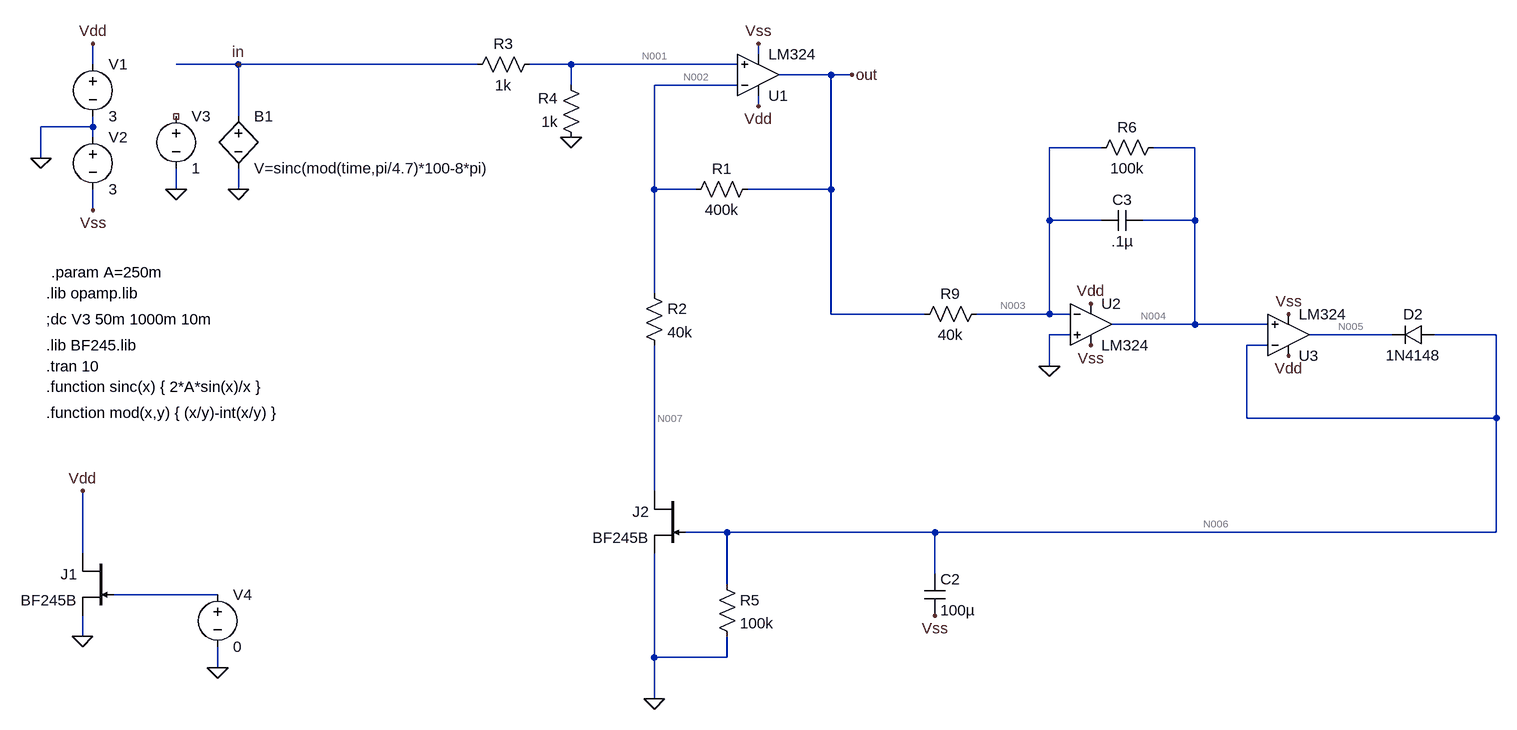
[diagram p0: schematic agc_8.asc]
agc_8.asc, the LTspice schematic file:
Version 4
SHEET 1 2280 940
WIRE 224 -176 224 -192
WIRE -800 -160 -800 -192
WIRE -576 -160 -672 -160
WIRE -208 -160 -576 -160
WIRE -64 -160 -128 -160
WIRE 192 -160 -64 -160
WIRE 336 -144 256 -144
WIRE 368 -144 336 -144
WIRE -64 -128 -64 -160
WIRE 192 -128 64 -128
WIRE 224 -96 224 -112
WIRE -576 -80 -576 -160
WIRE -800 -64 -800 -80
WIRE -800 -64 -880 -64
WIRE -800 -48 -800 -64
WIRE 752 -32 672 -32
WIRE 896 -32 832 -32
WIRE -880 -16 -880 -64
WIRE -672 32 -672 0
WIRE -576 32 -576 0
WIRE 64 32 64 -128
WIRE 128 32 64 32
WIRE 336 32 336 -144
WIRE 336 32 208 32
WIRE -800 64 -800 32
WIRE 672 80 672 -32
WIRE 752 80 672 80
WIRE 896 80 896 -32
WIRE 896 80 816 80
WIRE 64 192 64 32
WIRE 336 224 336 32
WIRE 480 224 336 224
WIRE 672 224 672 80
WIRE 672 224 560 224
WIRE 704 224 672 224
WIRE 896 240 896 80
WIRE 896 240 768 240
WIRE 1008 240 896 240
WIRE 704 256 672 256
WIRE 1200 256 1072 256
WIRE 1360 256 1264 256
WIRE 1008 272 976 272
WIRE 672 304 672 256
WIRE 976 384 976 272
WIRE 1360 384 1360 256
WIRE 1360 384 976 384
WIRE 64 496 64 272
WIRE 176 560 112 560
WIRE 496 560 176 560
WIRE 1360 560 1360 384
WIRE 1360 560 496 560
WIRE -816 592 -816 496
WIRE 496 624 496 560
WIRE 176 640 176 560
WIRE -608 656 -768 656
WIRE -816 720 -816 688
WIRE 64 752 64 592
WIRE 176 752 176 720
WIRE 176 752 64 752
WIRE -608 768 -608 736
WIRE 64 816 64 752
FLAG -880 -16 0
FLAG -800 -192 Vdd
FLAG 224 -96 Vdd
FLAG 224 -192 Vss
FLAG -800 64 Vss
FLAG -576 32 0
FLAG 368 -144 out
FLAG -576 -160 in
FLAG -816 720 0
FLAG -816 496 Vdd
FLAG -608 768 0
FLAG 1040 224 Vss
FLAG 1040 288 Vdd
FLAG 64 816 0
FLAG -64 -48 0
FLAG -672 32 0
FLAG 736 272 Vss
FLAG 736 208 Vdd
FLAG 672 304 0
FLAG 496 688 Vss
SYMBOL voltage -800 -176 R0
SYMATTR InstName V1
SYMATTR Value 3
SYMBOL voltage -800 -64 R0
SYMATTR InstName V2
SYMATTR Value 3
SYMBOL res 224 16 R90
WINDOW 0 0 56 VBottom 2
WINDOW 3 32 56 VTop 2
SYMATTR InstName R1
SYMATTR Value 400k
SYMBOL njf -768 592 M0
SYMATTR InstName J1
SYMATTR Value BF245B
SYMBOL voltage -608 640 R0
SYMATTR InstName V4
SYMATTR Value 0
SYMBOL Opamps\\opamp2 224 -80 M180
SYMATTR InstName U1
SYMATTR Value LM324
SYMBOL Opamps\\opamp2 1040 320 M180
SYMATTR InstName U3
SYMATTR Value LM324
SYMBOL diode 1264 240 R90
WINDOW 0 0 32 VBottom 2
WINDOW 3 32 32 VTop 2
SYMATTR InstName D2
SYMATTR Value 1N4148
SYMBOL njf 112 496 M0
SYMATTR InstName J2
SYMATTR Value BF245B
SYMBOL res 48 176 R0
SYMATTR InstName R2
SYMATTR Value 40k
SYMBOL res 160 624 R0
SYMATTR InstName R5
SYMATTR Value 100k
SYMBOL res -112 -176 R90
WINDOW 0 0 56 VBottom 2
WINDOW 3 32 56 VTop 2
SYMATTR InstName R3
SYMATTR Value 1k
SYMBOL res -48 -32 R180
WINDOW 0 36 76 Left 2
WINDOW 3 36 40 Left 2
SYMATTR InstName R4
SYMATTR Value 1k
SYMBOL bv -576 -96 R0
SYMATTR InstName B1
SYMATTR Value V=sinc(mod(time,pi/4.7)*100-8*pi)
SYMBOL voltage -672 -96 R0
SYMATTR InstName V3
SYMATTR Value 1
SYMBOL res 576 208 R90
WINDOW 0 0 56 VBottom 2
WINDOW 3 32 56 VTop 2
SYMATTR InstName R9
SYMATTR Value 40k
SYMBOL Opamps\\opamp2 736 176 R0
SYMATTR InstName U2
SYMATTR Value LM324
SYMBOL cap 816 64 R90
WINDOW 0 0 32 VBottom 2
WINDOW 3 32 32 VTop 2
SYMATTR InstName C3
SYMATTR Value .1µ
SYMBOL res 848 -48 R90
WINDOW 0 0 56 VBottom 2
WINDOW 3 32 56 VTop 2
SYMATTR InstName R6
SYMATTR Value 100k
SYMBOL cap 480 624 R0
SYMATTR InstName C2
SYMATTR Value 100µ
TEXT -872 232 Left 2 !;dc V3 50m 1000m 10m
TEXT -872 192 Left 2 !.lib opamp.lib
TEXT -872 272 Left 2 !.lib BF245.lib
TEXT -872 304 Left 2 !.tran 10
TEXT -872 336 Left 2 !.function sinc(x) { 2*A*sin(x)/x }
TEXT -872 376 Left 2 !.function mod(x,y) { (x/y)-int(x/y) }
TEXT -864 160 Left 2 !.param A=250m

The netlist it stands for:
* agc_8.asc
V1 Vdd 0 3
V2 0 Vss 3
R1 out N002 400k
J1 Vdd N008 0 BF245B
V4 N008 0 0
XU1 N001 N002 Vdd Vss out LM324  ; pins In+ In- V+ V- OUT
XU3 N004 N006 Vdd Vss N005 LM324  ; pins In+ In- V+ V- OUT
D2 N006 N005 1N4148
J2 N007 N006 0 BF245B
R2 N002 N007 40k
R5 N006 0 100k
R3 N001 in 1k
R4 0 N001 1k
B1 in 0 V=sinc(mod(time,pi/4.7)*100-8*pi)
V3 NC_01 0 1
R9 N003 out 40k
XU2 0 N003 Vdd Vss N004 LM324  ; pins In+ In- V+ V- OUT
C3 N004 N003 .1µ
R6 N004 N003 100k
C2 N006 Vss 100µ
.model D D
.lib standard.dio
.model NJF NJF
.model PJF PJF
.lib standard.jft
;dc V3 50m 1000m 10m
.lib opamp.lib
.lib BF245.lib
.tran 10
.function sinc(x) { 2*A*sin(x)/x }
.function mod(x,y) { (x/y)-int(x/y) }
.param A=250m
.backanno
.end

* Results of the author's LTspice run, read from the files saved beside the schematic
* Operating Point, zero values left out:
*   V(vdd) = 3 V
*   V(vss) = -3 V
*   V(out) = -19.84 mV
*   V(n002) = -169.9 µV
*   V(n001) = 22.37 µV
*   V(n005) = 2.316 V
*   V(n006) = 6.761 mV
*   V(n004) = 44.44 mV
*   V(n007) = -902.7 nV
*   V(n003) = -193 µV
*   I(B1) = 22.37 nA
*   I(D2) = -2.522 nA
*   Id(J2) = -4.226 nA
*   Is(J2) = 4.226 nA
*   Id(J1) = 5.956 mA
*   Ig(J1) = -3 pA
*   Is(J1) = -5.956 mA
*   I(R6) = 446.3 nA
*   I(R9) = 491.3 nA
*   I(R4) = -22.37 nA
*   I(R3) = 22.37 nA
*   I(R5) = 67.61 nA
*   I(R2) = -4.226 nA
*   I(R1) = -49.19 nA
*   I(V4) = 3 pA
*   I(V2) = -2.341 mA
*   I(V1) = -8.297 mA
*   Ix(u1:1) = -44.74 nA
*   Ix(u1:2) = -44.96 nA
*   Ix(u1:3) = 988.6 µA
*   Ix(u1:4) = -989 µA
*   Ix(u1:5) = 540.5 nA
*   Ix(u3:1) = -24.61 nA
*   Ix(u3:2) = -65.09 nA
*   Ix(u3:3) = 676 µA
*   Ix(u3:4) = -675.9 µA
*   Ix(u3:5) = -2.522 nA
*   Ix(u2:1) = -44.74 nA
*   Ix(u2:2) = -44.96 nA
*   Ix(u2:3) = 676.5 µA
*   Ix(u2:4) = -675.9 µA
*   Ix(u2:5) = -421.7 nA
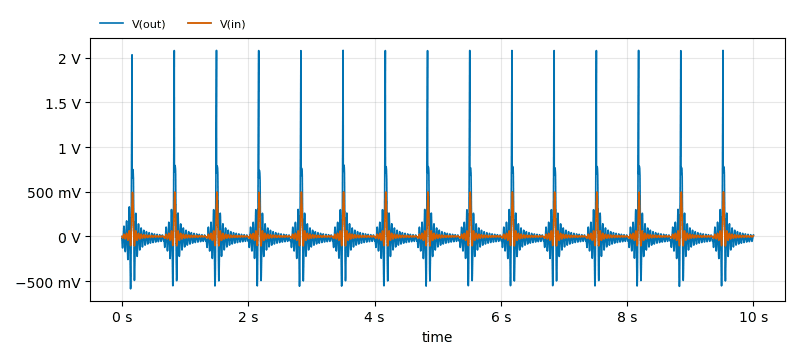
[diagram p1: Transient Analysis of agc_8.asc, plotted from the saved traces]
* Transient Analysis, 1 run:
*   V(out): min -586.6 mV, max 2.083 V, average 17.68 mV, rms 263.9 mV, last 15.9 mV
*   V(in): min -106.1 mV, max 497.7 mV, average 15.6 mV, rms 87.67 mV, last 6.959 mV